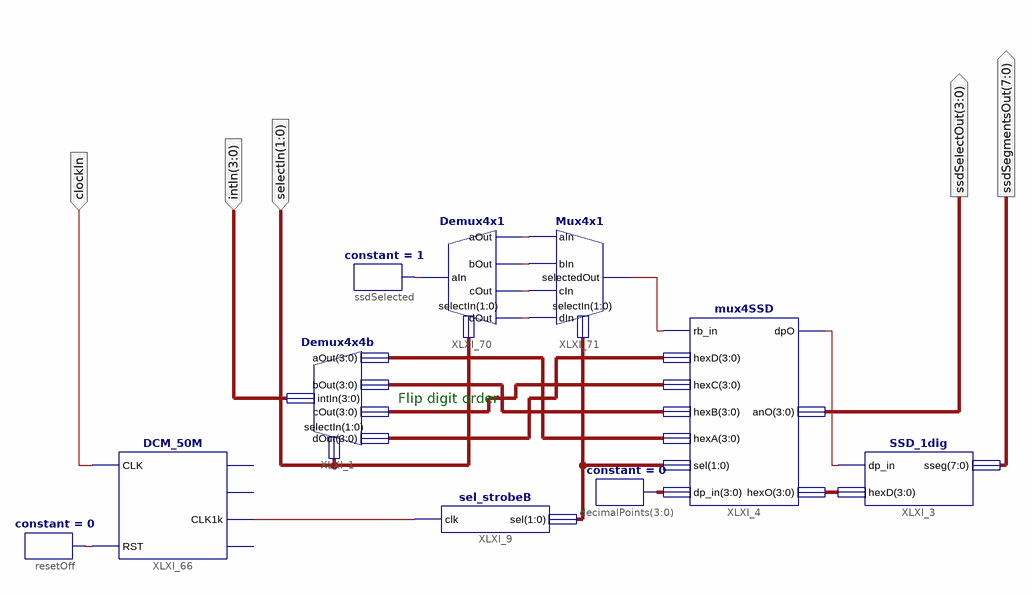
[diagram p0: schematic sheet 1]
// Xilinx ISE schematic Experiment6.sch (spartan3e) as structural Verilog: 10 symbols, 5 ports
module Experiment6 (
  input  [3:0] intIn,
  input  [1:0] selectIn,
  input  clockIn,
  output [7:0] ssdSegmentsOut,
  output [3:0] ssdSelectOut
);

  wire XLXN_17, XLXN_298, XLXN_463, XLXN_487, XLXN_488, XLXN_489, XLXN_490, XLXN_496, XLXN_502;
  wire [1:0] XLXN_459;
  wire [3:0] XLXN_18, XLXN_456, XLXN_562, XLXN_563, XLXN_564, XLXN_565;

  mux4SSD XLXI_4 (
    .rb_in(XLXN_502), .hexD(XLXN_564), .hexC(XLXN_563), .hexB(XLXN_562), .hexA(XLXN_565), .sel(XLXN_459),
    .dp_in(XLXN_456), .dpO(XLXN_17), .anO(ssdSelectOut), .hexO(XLXN_18));
  constant #(.CValue("0")) decimalPoints[3:0] (.O(XLXN_456));
  SSD_1dig XLXI_3 (.dp_in(XLXN_17), .hexD(XLXN_18), .sseg(ssdSegmentsOut));
  Demux4x4b XLXI_1 (
    .aOut(XLXN_565), .bOut(XLXN_562), .cOut(XLXN_563), .dOut(XLXN_564), .selectIn(selectIn), .intIn(intIn));
  constant #(.CValue("0")) resetOff (.O(XLXN_298));
  DCM_50M XLXI_66 (.CLK(clockIn), .RST(XLXN_298), .CLK1k(XLXN_463));  // open: CLK1M, CLK10k, CLK1
  sel_strobeB XLXI_9 (.clk(XLXN_463), .sel(XLXN_459));
  Demux4x1 XLXI_70 (
    .selectIn(selectIn), .aIn(XLXN_496), .aOut(XLXN_487), .bOut(XLXN_488), .cOut(XLXN_489), .dOut(XLXN_490));
  Mux4x1 XLXI_71 (
    .selectedOut(XLXN_502), .aIn(XLXN_487), .bIn(XLXN_488), .cIn(XLXN_489), .dIn(XLXN_490),
    .selectIn(XLXN_459));
  constant #(.CValue("1")) ssdSelected (.O(XLXN_496));

  // Notes on the sheet:
  //   Flip digit order
endmodule
